# EAGLE design BiphasicBoard (EAGLE 6.5.0)
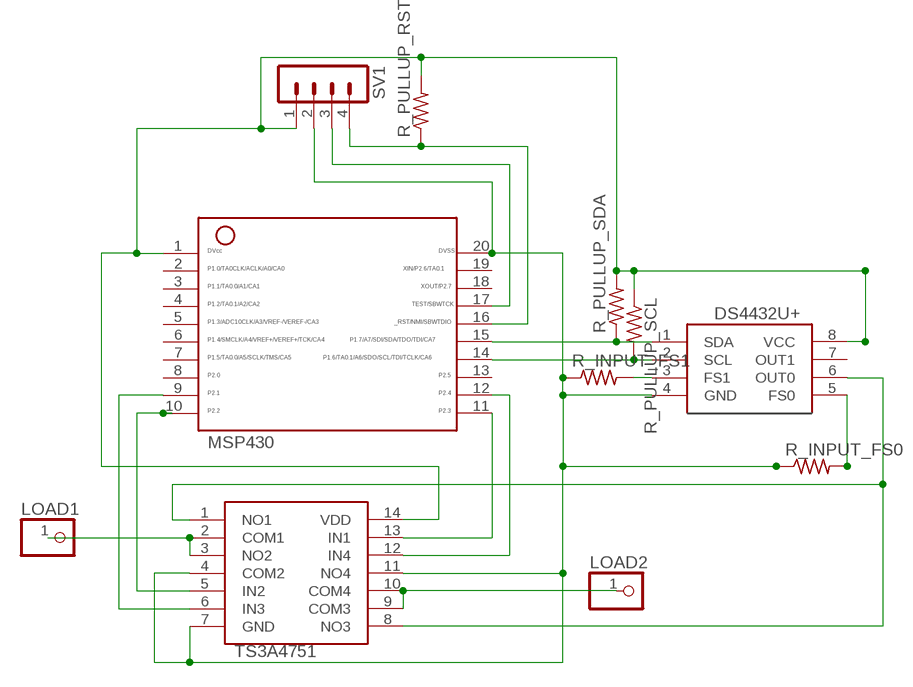
[diagram p0: schematic, sheet 1]

## Parts
DS4432U+  DS4432U+  [8_PIN]
LOAD1  PINHD-1X1  [1X01]
LOAD2  PINHD-1X1  [1X01]
MSP430  MSP430  [20_PIN]
R_INPUT_FS0  R-US_R0603  [R0603]
R_INPUT_FS1  R-US_R0603  [R0603]
R_PULLUP_RST  R-US_R0603  [R0603]
R_PULLUP_SCL  R-US_R0603  [R0603]
R_PULLUP_SDA  R-US_R0603  [R0603]
SV1  MA04-1  [MA04-1]
TS3A4751  TS3A4751  [14_PIN]

## Nets
_RST: MSP430.16 R_PULLUP_RST.1 SV1.4
CURRENT0: DS4432U+.6(OUT0) TS3A4751.1(NO1) TS3A4751.8(NO3)
GND: DS4432U+.4(GND) MSP430.20 R_INPUT_FS0.1 R_INPUT_FS1.1 SV1.2 TS3A4751.4(COM2) TS3A4751.7(GND) TS3A4751.11(NO4)
IN1: MSP430.11 TS3A4751.13(IN1)
IN4: MSP430.12 TS3A4751.12(IN4)
LOAD1: LOAD1.1 TS3A4751.2(COM1) TS3A4751.3(NO2)
LOAD2: LOAD2.1 TS3A4751.9(COM3) TS3A4751.10(COM4)
N$1: DS4432U+.2(SCL) MSP430.14 R_PULLUP_SCL.2
N$2: DS4432U+.1(SDA) MSP430.15 R_PULLUP_SDA.1
N$4: MSP430.10 TS3A4751.5(IN2)
N$8: DS4432U+.5(FS0) R_INPUT_FS0.2
N$9: MSP430.9 TS3A4751.6(IN3)
TEST: MSP430.17 SV1.3
VDD: DS4432U+.8(VCC) MSP430.1 R_PULLUP_RST.2 R_PULLUP_SCL.1 R_PULLUP_SDA.2 SV1.1 TS3A4751.14(VDD)
VIA1: DS4432U+.3(FS1) R_INPUT_FS1.2
Unconnected: DS4432U+.7(OUT1) MSP430.2 MSP430.3 MSP430.4 MSP430.5 MSP430.6 MSP430.7 MSP430.8 MSP430.13 MSP430.18 MSP430.19

## Library data of the parts
DS4432U+ = BiphasicBoard:DS4432U+: DS4432U+ current DAC
LOAD1 LOAD2 = BiphasicBoard:PINHD-1X1: PIN HEADER
MSP430 = BiphasicBoard:MSP430: MSP430 20 pins
R_INPUT_FS0 R_INPUT_FS1 R_PULLUP_RST R_PULLUP_SCL R_PULLUP_SDA = BiphasicBoard:R-US_: RESISTOR, American symbol
SV1 = BiphasicBoard:MA04-1: PIN HEADER; OC_FARNELL: unknown; OC_NEWARK: unknown
TS3A4751 = BiphasicBoard:TS3A4751: TS3A4751 Quad Switch

## Board
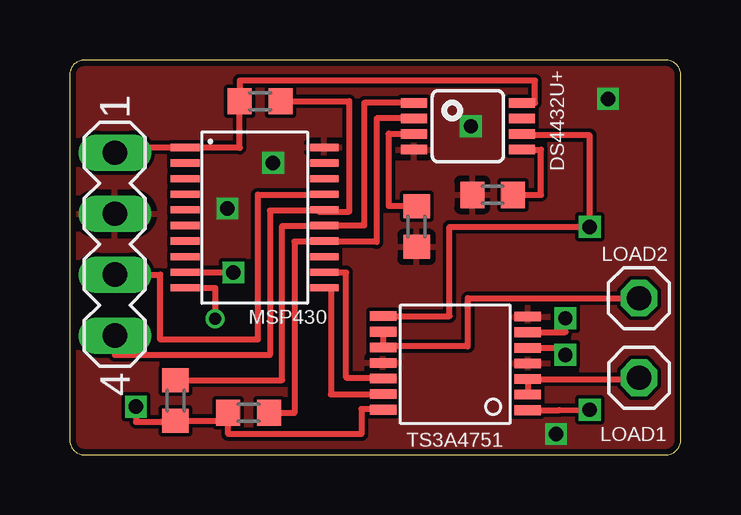
[diagram p1: board, top side]
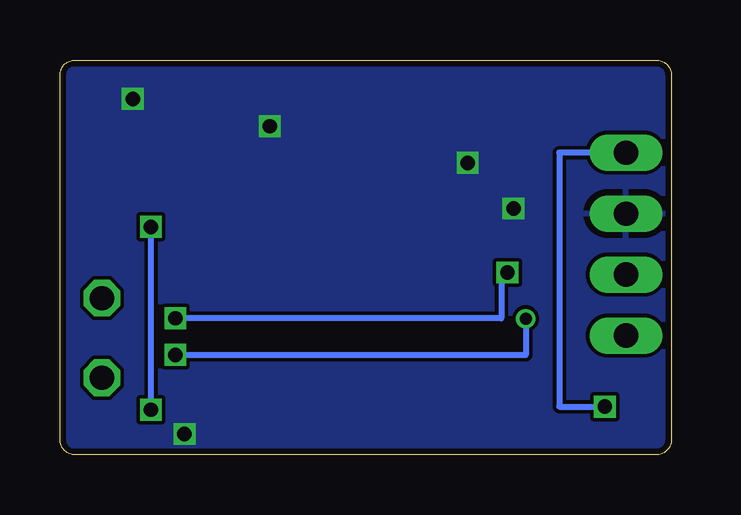
[diagram p2: board, bottom side, seen from below]

Size 25.49 x 16.45 mm. Coordinates in mm from the lower left corner, seen from the top.
Outline: 0,15.82 0,0.64 arc90 0.64,0 24.86,0 arc90 25.49,0.64 25.49,15.82 arc90 24.86,16.45 0.64,16.45 arc90 0,15.82
Copper layers (1*16): Top 0.035mm / dielectric 1.5mm / Bottom 0.035mm
Design rules "Seeed_DRU": minimum track width 6mil, minimum drill 12mil, track to track 6mil, track to pad 6mil, pad to pad 6mil, via to via 6mil, smd to smd 0mil, copper to edge 10mil, drill to drill 10mil, minimum pad ring 10mil, minimum via ring 6mil, stop-mask expansion 2mil, vias tented up to drill 100mil, thermal gap 10mil

### Footprints (pad centres in the part's own frame; a part is rotated, then mirrored left to right if it is on the bottom)
8_PIN = smd 1.1 x 0.4: 1 -2.25,0.975; 2 -2.25,0.325; 3 -2.25,-0.325; 4 -2.25,-0.975; 5 2.25,-0.975; 6 2.25,-0.325; 7 2.25,0.325; 8 2.25,0.975
1X01 = drill 1.016 octagon: 1 0,0
20_PIN = smd 0.3 x 1.2: 1 -2.925,-2.9; 2 -2.275,-2.9; 3 -1.625,-2.9; 4 -0.975,-2.9; 5 -0.325,-2.9; 6 0.325,-2.9; 7 0.975,-2.9; 8 1.625,-2.9; 9 2.275,-2.9; 10 2.925,-2.9; 11 2.925,2.9; 12 2.275,2.9; 13 1.625,2.9; 14 0.975,2.9; 15 0.325,2.9; 16 -0.325,2.9; 17 -0.975,2.9; 18 -1.625,2.9; 19 -2.275,2.9; 20 -2.925,2.9
R0603 = smd 1 x 1.1: 1 -0.85,0; 2 0.85,0
MA04-1 = drill 1.016 long: 1 -3.81,0; 2 -1.27,0; 3 1.27,0; 4 3.81,0
14_PIN = smd 1.1 x 0.4: 1 -3.26,1.165; 2 -3.26,0.515; 3 -3.26,-0.135; 4 -3.26,-0.785; 5 -3.26,-1.435; 6 -3.26,-2.085; 7 -3.26,-2.735; 8 2.77,-2.755; 9 2.77,-2.105; 10 2.77,-1.455; 11 2.77,-0.805; 12 2.77,-0.155; 13 2.77,0.495; 14 2.77,1.145

### Placement (x,y rotation side)
DS4432U+  16.61,13.69 0 top
LOAD1  23.75,3.21 0 top
LOAD2  23.74,6.53 0 top
MSP430  7.72,9.88 270 top
R_INPUT_FS0  17.64,10.84 0 top
R_INPUT_FS1  14.47,9.52 90 top
R_PULLUP_RST  7.95,14.74 180 top
R_PULLUP_SCL  7.47,1.76 0 top
R_PULLUP_SDA  4.42,2.26 270 top
SV1  1.89,8.78 270 top
TS3A4751  15.85,3.03 180 top

### Tracks (layer width: path | path; a pad name or v marks a point on that pad's centre or on a via)
_RST
  Top 0.254: R_PULLUP_RST.1 11.66,14.74 11.66,10.14 10.39,10.14 10.39,10.21 MSP430.16 10.62,10.19 8.36,10.19 8.36,4.17 1.89,4.17 SV1.4
CURRENT0  (via drill 0.6)
  Top 0.254: TS3A4751.8 15.85,5.78 15.85,9.5 v21.69,9.5 21.69,13.31 18.86,13.31 DS4432U+.6 | TS3A4751.1 20.42,1.86 v21.69,1.88
  Bottom 0.254: v21.69,1.88 v21.69,9.5
GND  (via drill 0.6)
  other vias: 8.49,12.17 6.58,10.27 22.46,14.84 20.3,0.87 16.74,13.69
  pour Top: -0.02,16.36 25.5,16.36 25.5,-0.02 -0.02,-0.02
  pour Bottom: -0.02,16.49 25.5,16.49 25.5,-0.02 -0.02,-0.02
IN1
  Top 0.254: MSP430.11 10.9,6.96 10.9,2.52 TS3A4751.13
IN4
  Top 0.254: MSP430.12 11.53,7.61 11.53,3.22 13.08,3.22 TS3A4751.12
LOAD1
  Top 0.254: TS3A4751.2 TS3A4751.3 23.75,3.16 LOAD1.1
LOAD2
  Top 0.254: 13.08,4.52 16.61,4.52 16.61,6.53 LOAD2.1 | TS3A4751.9 13.08,4.52 | 13.08,4.52 TS3A4751.10
N$1
  Top 0.254: R_PULLUP_SCL.2 9.38,1.76 9.38,8.89 10.62,8.89 MSP430.14 12.8,8.91 | DS4432U+.2 12.8,14.02 12.8,8.91 | 12.8,8.91 12.8,8.87
N$2
  Top 0.254: R_PULLUP_SDA.1 8.87,3.11 8.87,9.54 10.62,9.54 MSP430.15 12.3,9.56 12.3,14.67 DS4432U+.1
N$4  (via drill 0.5, 0.6)
  Top 0.254: v6.07,5.67 6.07,6.96 MSP430.10 | TS3A4751.5 20.68,4.46 v20.68,4.17
  Bottom 0.254: v6.07,5.67 6.07,4.17 v20.68,4.17
N$8
  Top 0.254: R_INPUT_FS0.2 19.66,10.84 19.66,12.72 | DS4432U+.5 19.66,12.72 | 19.66,12.72 19.66,12.73
N$9  (via drill 0.6)
  Top 0.254: MSP430.9 v6.83,7.61 v6.83,7.6 | TS3A4751.6 20.68,5.11 v20.68,5.69
  Bottom 0.254: v6.83,7.6 7.09,7.6 7.09,5.69 v20.68,5.69
TEST
  Top 0.254: MSP430.17 10.62,10.84 7.85,10.84 7.85,4.8 3.79,4.8 3.79,7.51 SV1.3
VDD  (via drill 0.6)
  Top 0.254: 7.1,12.81 R_PULLUP_RST.2 7.1,15.6 19.41,15.6 19.41,14.67 DS4432U+.8 | 6.62,1.41 R_PULLUP_SDA.2 4.42,1.38 2.77,1.38 v2.77,2.01 | 6.62,1.41 6.62,0.87 12.17,0.87 12.17,1.92 13.08,1.92 TS3A4751.14 | 6.62,1.41 R_PULLUP_SCL.1 | 7.1,12.81 MSP430.1 1.89,12.81 SV1.1 | 7.1,12.81 7.1,12.79
  Bottom 0.254: SV1.1 4.68,12.59 4.68,2.01 v2.77,2.01
VIA1
  Top 0.254: 13.31,13.37 13.31,10.37 R_INPUT_FS1.2 | DS4432U+.3 13.31,13.37 | 13.31,13.37 13.31,13.38

### Text on the board
bDocu: Biphasic Stim Generator / Version 1.0 / (C) Tam Vu May 2014 / Kemere Lab